# EAGLE schematic untitled (EAGLE 9.5.0)
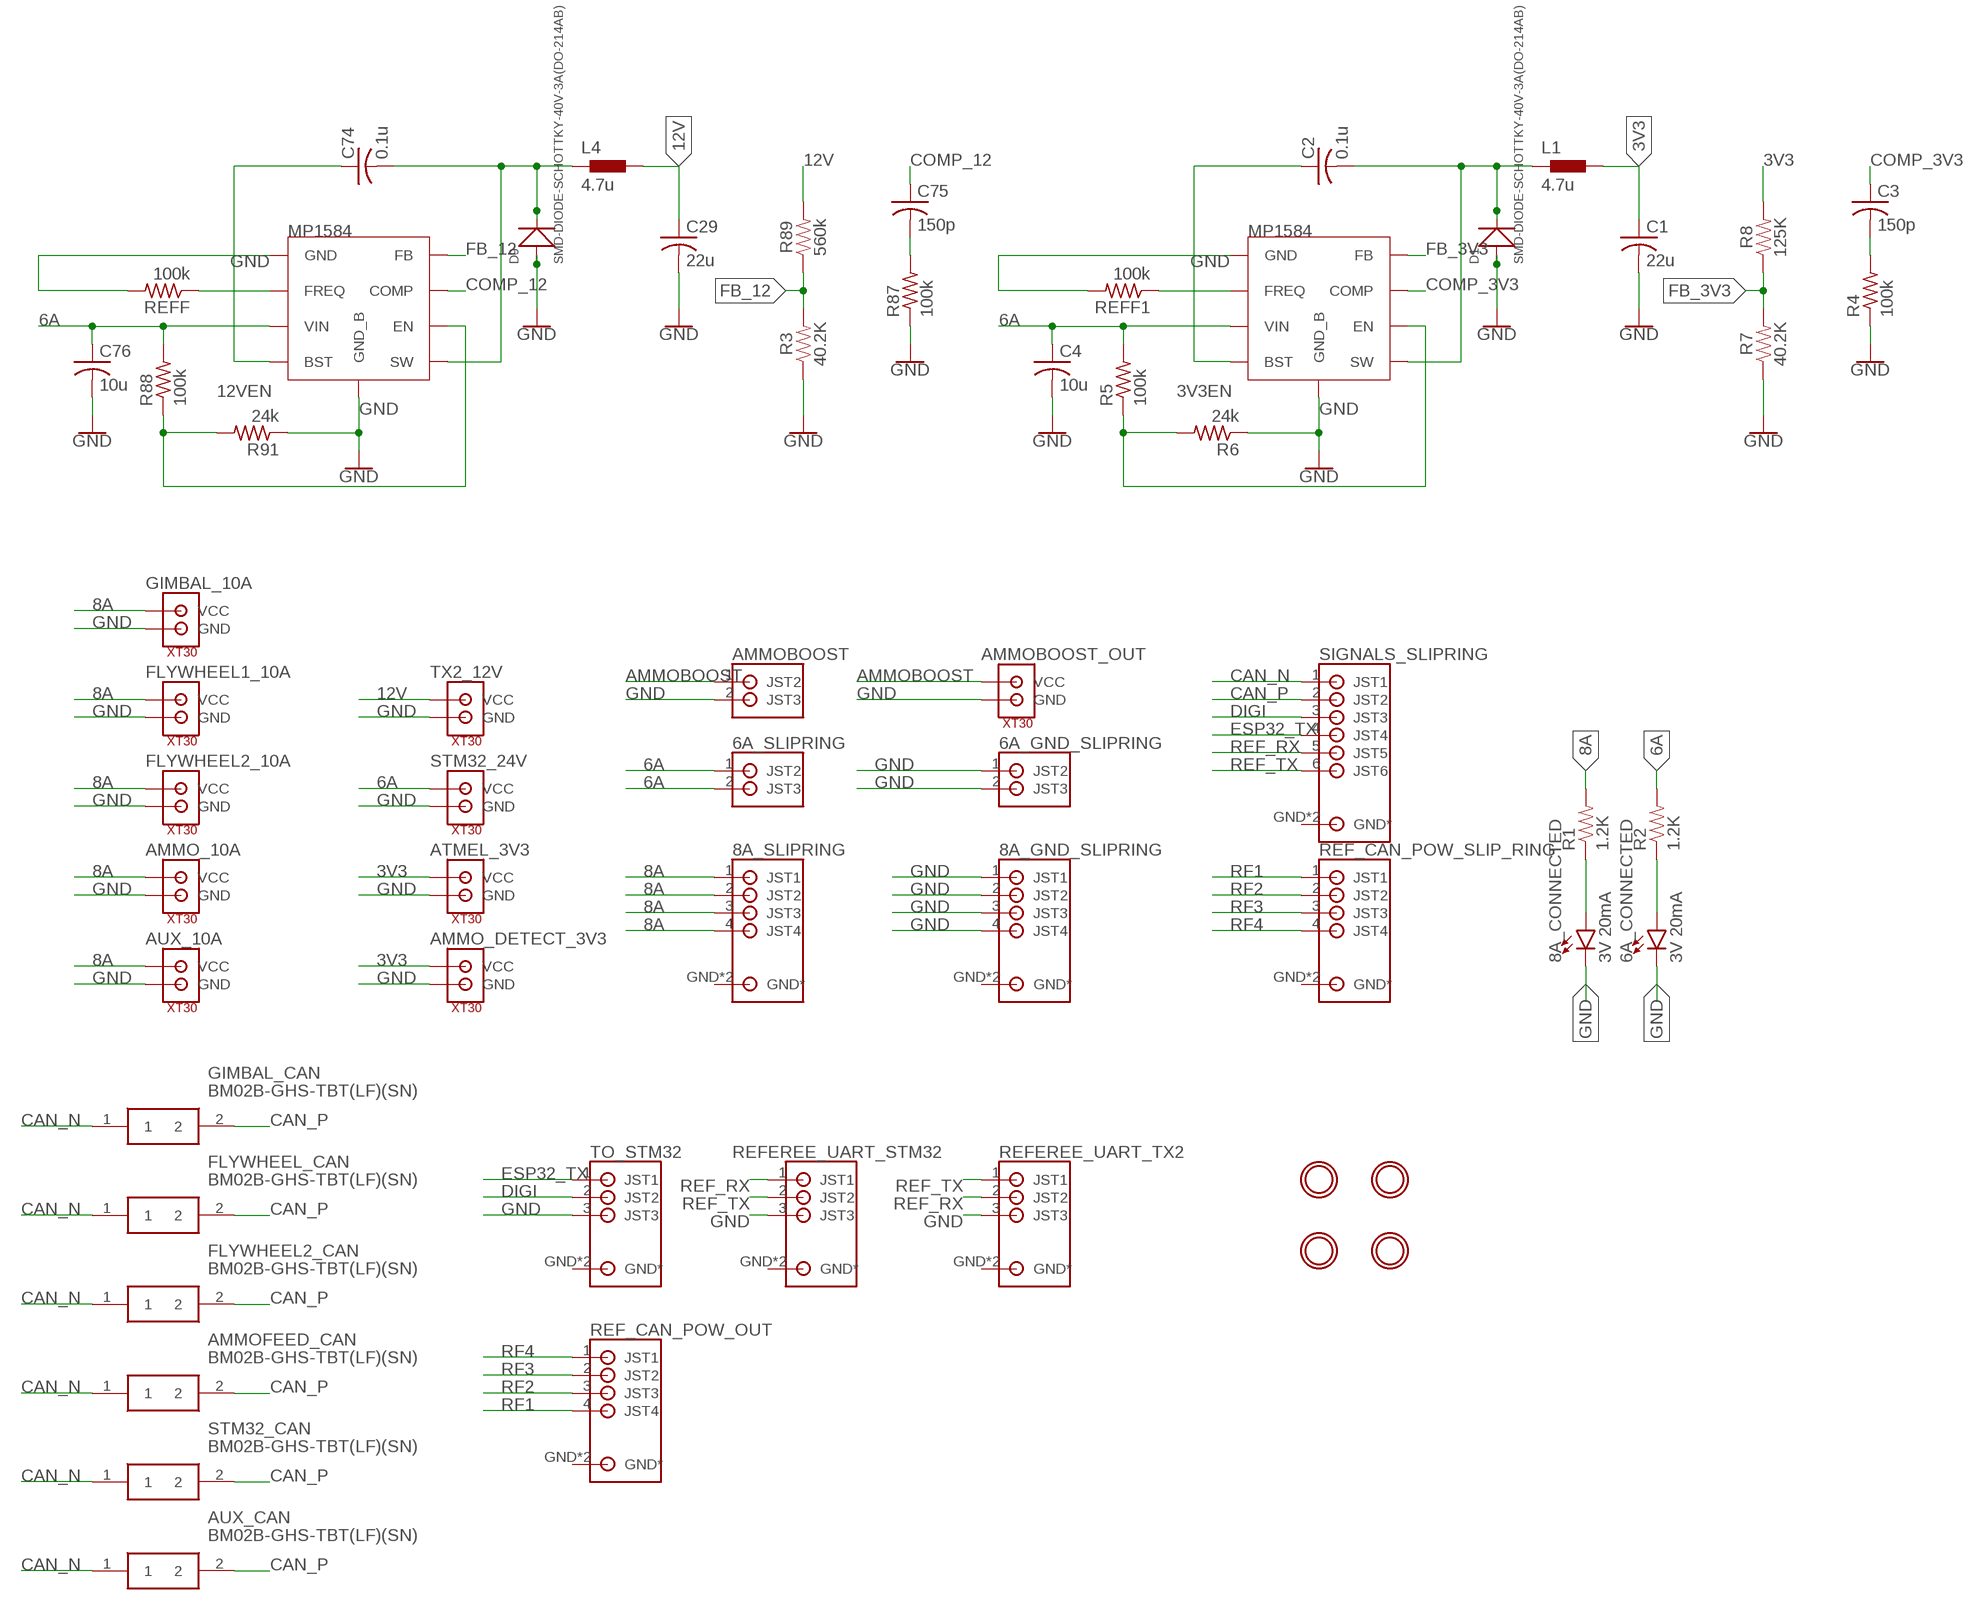
[diagram p0: schematic, sheet 1]

## Parts
6A_CONNECTED  3V 20mA  LED1206  [LED-1206]
6A_GND_SLIPRING  S2B-PH-SM4_TB  [S2B-PH-SM4_TB]
6A_SLIPRING  S2B-PH-SM4_TB  [S2B-PH-SM4_TB]
8A_CONNECTED  3V 20mA  LED1206  [LED-1206]
8A_GND_SLIPRING  S4B-PH-SM4_TB  [S4B-PH-SM4_TB]
8A_SLIPRING  S4B-PH-SM4_TB  [S4B-PH-SM4_TB]
AMMO_10A  XT30  [XT30]
AMMO_DETECT_3V3  XT30  [XT30]
AMMOBOOST  S2B-PH-SM4_TB  [S2B-PH-SM4_TB]
AMMOBOOST_OUT  XT30  [XT30]
AMMOFEED_CAN  BM02B-GHS-TBT(LF)(SN)  [BM02B-GHS-TBT_1]
ATMEL_3V3  XT30  [XT30]
AUX_10A  XT30  [XT30]
AUX_CAN  BM02B-GHS-TBT(LF)(SN)  [BM02B-GHS-TBT_1]
C1  22u  C-USC1206  [C1206]
C2  0.1u  C-USC0603  [C0603]
C3  150p  C-USC0603  [C0603]
C4  10u  C-USC1206  [C1206]
C29  22u  C-USC1206  [C1206]
C74  0.1u  C-USC0603  [C0603]
C75  150p  C-USC0603  [C0603]
C76  10u  C-USC1206  [C1206]
D1  SMD-DIODE-SCHOTTKY-40V-3A(DO-214AB)  [DO-214AB]
D9  SMD-DIODE-SCHOTTKY-40V-3A(DO-214AB)  [DO-214AB]
FLYWHEEL1_10A  XT30  [XT30]
FLYWHEEL2_10A  XT30  [XT30]
FLYWHEEL2_CAN  BM02B-GHS-TBT(LF)(SN)  [BM02B-GHS-TBT_1]
FLYWHEEL_CAN  BM02B-GHS-TBT(LF)(SN)  [BM02B-GHS-TBT_1]
GIMBAL_10A  XT30  [XT30]
GIMBAL_CAN  BM02B-GHS-TBT(LF)(SN)  [BM02B-GHS-TBT_1]
L1  4.7u  MHCI0603-4R7M-R8  [MHCI0603-4R7M-R8]
L4  4.7u  MHCI0603-4R7M-R8  [MHCI0603-4R7M-R8]
R1  1.2K  RESISTOR2010  [R2010]
R2  1.2K  RESISTOR2010  [R2010]
R3  40.2K  220KOHM-0603-1/10W-1%  [0603]
R4  100k  R-US_R0603  [R0603]
R5  100k  R-US_R0603  [R0603]
R6  24k  R-US_R0603  [R0603]
R7  40.2K  220KOHM-0603-1/10W-1%  [0603]
R8  125K  RESISTOR0603  [0603]
R87  100k  R-US_R0603  [R0603]
R88  100k  R-US_R0603  [R0603]
R89  560k  RESISTOR0603  [0603]
R91  24k  R-US_R0603  [R0603]
REF_CAN_POW_OUT  S4B-PH-SM4_TB  [S4B-PH-SM4_TB]
REF_CAN_POW_SLIP_RING  S4B-PH-SM4_TB  [S4B-PH-SM4_TB]
REFEREE_UART_STM32  S3B-PH-SM4_TB  [S3B-PH-SM4_TB]
REFEREE_UART_TX2  S3B-PH-SM4_TB  [S3B-PH-SM4_TB]
REFF  100k  R-US_R0603  [R0603]
REFF1  100k  R-US_R0603  [R0603]
SIGNALS_SLIPRING  S6B-PH-SM4_TB  [S6B-PH-SM4_TB]
STM32_24V  XT30  [XT30]
STM32_CAN  BM02B-GHS-TBT(LF)(SN)  [BM02B-GHS-TBT_1]
TO_STM32  S3B-PH-SM4_TB  [S3B-PH-SM4_TB]
TX2_12V  XT30  [XT30]
U$1  MOUNTINGHOLE2.5  [MOUNTINGHOLE_2.5_PLATED]
U$2  MOUNTINGHOLE2.5  [MOUNTINGHOLE_2.5_PLATED]
U$3  MP1584_V2  [MP1584_V2]
U$4  MOUNTINGHOLE2.5  [MOUNTINGHOLE_2.5_PLATED]
U$5  MP1584_V2  [MP1584_V2]
U$49  MOUNTINGHOLE2.5  [MOUNTINGHOLE_2.5_PLATED]

## Nets
3V3 [Power]: AMMO_DETECT_3V3.P$2(VCC) ATMEL_3V3.P$2(VCC) C1.1 L1.P$2 R8.2
3V3EN: R5.1 R6.2 U$5.EN
6A: 6A_SLIPRING.1(JST2) 6A_SLIPRING.2(JST3) C4.1 C76.1 R2.2 R5.2 R88.2 STM32_24V.P$2(VCC) U$3.VIN U$5.VIN
8A: 8A_SLIPRING.1(JST1) 8A_SLIPRING.2(JST2) 8A_SLIPRING.3(JST3) 8A_SLIPRING.4(JST4) AMMO_10A.P$2(VCC) AUX_10A.P$2(VCC) FLYWHEEL1_10A.P$2(VCC) FLYWHEEL2_10A.P$2(VCC) GIMBAL_10A.P$2(VCC) R1.2
12V [Power]: C29.1 L4.P$2 R89.2 TX2_12V.P$2(VCC)
12VEN: R88.1 R91.2 U$3.EN
AMMOBOOST: AMMOBOOST.1(JST2) AMMOBOOST_OUT.P$2(VCC)
BST: C74.1 U$3.BST
BST1: C2.1 U$5.BST
CAN_N: AMMOFEED_CAN.1 AUX_CAN.1 FLYWHEEL2_CAN.1 FLYWHEEL_CAN.1 GIMBAL_CAN.1 SIGNALS_SLIPRING.1(JST1) STM32_CAN.1
CAN_P: AMMOFEED_CAN.2 AUX_CAN.2 FLYWHEEL2_CAN.2 FLYWHEEL_CAN.2 GIMBAL_CAN.2 SIGNALS_SLIPRING.2(JST2) STM32_CAN.2
COMP_3V3: C3.1 U$5.COMP
COMP_12: C75.1 U$3.COMP
DIGI: SIGNALS_SLIPRING.3(JST3) TO_STM32.2(JST2)
ESP32_TX: SIGNALS_SLIPRING.4(JST4) TO_STM32.1(JST1)
FB_3V3: R7.2 R8.1 U$5.FB
FB_12: R3.2 R89.1 U$3.FB
FREQ: REFF.1 U$3.FREQ
FREQ1: REFF1.1 U$5.FREQ
GND: 6A_CONNECTED.C 6A_GND_SLIPRING.1(JST2) 6A_GND_SLIPRING.2(JST3) 8A_CONNECTED.C 8A_GND_SLIPRING.1(JST1) 8A_GND_SLIPRING.2(JST2) 8A_GND_SLIPRING.3(JST3) 8A_GND_SLIPRING.4(JST4) AMMO_10A.P$1(GND) AMMO_DETECT_3V3.P$1(GND) AMMOBOOST.2(JST3) AMMOBOOST_OUT.P$1(GND) ATMEL_3V3.P$1(GND) AUX_10A.P$1(GND) C1.2 C4.2 C29.2 C76.2 D1.1(+) D9.1(+) FLYWHEEL1_10A.P$1(GND) FLYWHEEL2_10A.P$1(GND) GIMBAL_10A.P$1(GND) R3.1 R4.1 R6.1 R7.1 R87.1 R91.1 REFEREE_UART_STM32.3(JST3) REFEREE_UART_TX2.3(JST3) REFF1.2 REFF.2 STM32_24V.P$1(GND) TO_STM32.3(JST3) TX2_12V.P$1(GND) U$3.GND U$3.GND_B U$5.GND U$5.GND_B
N$1 [sig]: 6A_CONNECTED.A R2.1
N$2 [sig]: 8A_CONNECTED.A R1.1
N$3: C3.2 R4.2
N$10: C75.2 R87.2
REF_RX: REFEREE_UART_STM32.1(JST1) REFEREE_UART_TX2.2(JST2) SIGNALS_SLIPRING.5(JST5)
REF_TX: REFEREE_UART_STM32.2(JST2) REFEREE_UART_TX2.1(JST1) SIGNALS_SLIPRING.6(JST6)
RF1: REF_CAN_POW_OUT.4(JST4) REF_CAN_POW_SLIP_RING.1(JST1)
RF2: REF_CAN_POW_OUT.3(JST3) REF_CAN_POW_SLIP_RING.2(JST2)
RF3: REF_CAN_POW_OUT.2(JST2) REF_CAN_POW_SLIP_RING.3(JST3)
RF4: REF_CAN_POW_OUT.1(JST1) REF_CAN_POW_SLIP_RING.4(JST4)
SW: C74.2 D9.2(-) L4.P$1 U$3.SW
SW1: C2.2 D1.2(-) L1.P$1 U$5.SW
Unconnected: 8A_GND_SLIPRING.GND2(GND*) 8A_GND_SLIPRING.GND(GND*) 8A_SLIPRING.GND2(GND*) 8A_SLIPRING.GND(GND*) REF_CAN_POW_OUT.GND2(GND*) REF_CAN_POW_OUT.GND(GND*) REF_CAN_POW_SLIP_RING.GND2(GND*) REF_CAN_POW_SLIP_RING.GND(GND*) REFEREE_UART_STM32.GND2(GND*) REFEREE_UART_STM32.GND(GND*) REFEREE_UART_TX2.GND2(GND*) REFEREE_UART_TX2.GND(GND*) SIGNALS_SLIPRING.GND2(GND*) SIGNALS_SLIPRING.GND(GND*) TO_STM32.GND2(GND*) TO_STM32.GND(GND*)

## Library data of the parts
6A_CONNECTED 8A_CONNECTED = SparkFun-LED:LED: LED (Generic) Standard schematic elements and footprints for 5mm, 3mm, 1206, and 0603 sized LEDs. Generic LEDs with no color specified.
6A_GND_SLIPRING 6A_SLIPRING AMMOBOOST = NewKevinMade:S2B-PH-SM4_TB
8A_GND_SLIPRING 8A_SLIPRING REF_CAN_POW_OUT REF_CAN_POW_SLIP_RING = NewKevinMade:S4B-PH-SM4_TB
AMMO_10A AMMO_DETECT_3V3 AMMOBOOST_OUT ATMEL_3V3 AUX_10A FLYWHEEL1_10A FLYWHEEL2_10A GIMBAL_10A STM32_24V TX2_12V = NewKevinMade:XT30
AMMOFEED_CAN AUX_CAN FLYWHEEL2_CAN FLYWHEEL_CAN GIMBAL_CAN STM32_CAN = SamacSys_Parts:BM02B-GHS-TBT(LF)(SN): GH 1.25mm header top entry 2 way JST GH Series, 1.25mm Pitch 2 Way Shrouded Straight PCB Header, Surface Mount, Solder Termination Source: Datasheet <http://uk.rs-online.com/web/p/products/7521762P>; DESCRIPTION: GH 1.25mm header top entry 2 way JST GH Series, 1.25mm Pitch 2 Way Shrouded Straight PCB Header, Surface Mount, Solder Termination; HEIGHT: mm; MANUFACTURER_NAME: JST (JAPAN SOLDERLESS TERMINALS); MANUFACTURER_PART_NUMBER: BM02B-GHS-TBT(LF)(SN); RS_PART_NUMBER: 7521762P
C1-C4 C29 C74-C76 = adafruit:C-US: CAPACITOR, American symbol
D1 D9 = SMD-DIODE-SCHOTTKY-40V-3A_DO-214AB_:SMD-DIODE-SCHOTTKY-40V-3A(DO-214AB): 304020018; AVAILABILITY: Unavailable; DESCRIPTION: Rectifier, Schottky; DO-214AB; 3.0A IF; 0.75V; 40V; 100A IFRM; 10000V/us; 1000pF; MF: Vishay; MP: SS34-E3/57T; PACKAGE: DO-214 Vishay; PRICE: None
L1 L4 = NewKevinMade:MHCI0603-4R7M-R8
R1 R2 = SparkFun-Passives:RESISTOR: Resistor Basic schematic elements and footprints for 0603, 1206, and PTH resistors.
R3 R7 = SparkFun-Resistors:220KOHM: 220kΩ resistor A resistor is a passive two-terminal electrical component that implements electrical resistance as a circuit element. Resistors act to reduce current flow, and, at the same time, act to lower voltage levels within circuits. - Wikipedia; PROD_ID: RES-08969; VALUE: 220k
R4-R6 R87 R88 R91 REFF REFF1 = adafruit:R-US_: RESISTOR, American symbol
R8 R89 = SparkFun-Resistors:RESISTOR: Generic Resistor Package
REFEREE_UART_STM32 REFEREE_UART_TX2 TO_STM32 = NewKevinMade:S3B-PH-SM4_TB
SIGNALS_SLIPRING = NewKevinMade:S6B-PH-SM4_TB
U$1 U$2 U$4 U$49 = microbuilder:MOUNTINGHOLE: Mounting Hole For #2 screws (0.086"/2.18mm width, 0.094"/2.4mm hole) use 2.5mm; BOM: EXCLUDE
U$3 U$5 = mp1584S:MP1584_V2

## Net classes
1 sig: width 0.254 mm, drill 0.305 mm, clearance 0.127 mm
2 Power: width 0.203 mm, drill 0.203 mm, clearance 0.203 mm